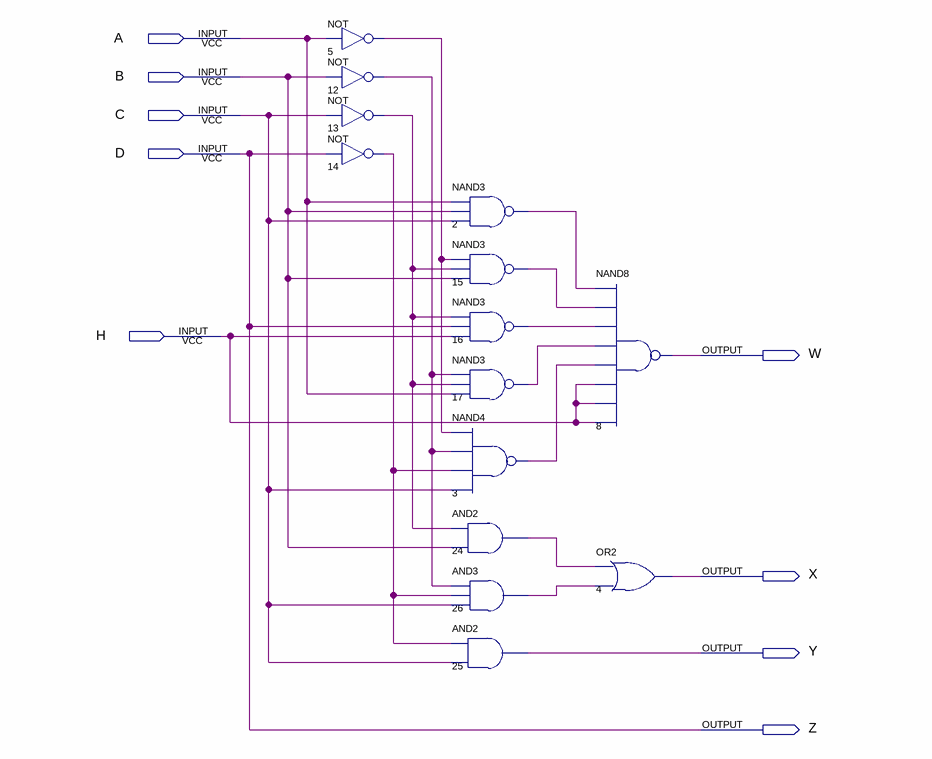
[diagram p0: schematic sheet]
// Quartus schematic codewandler_01.bdf as structural Verilog: 14 symbols, 9 pins
module codewandler_01 (
  input  A,
  input  B,
  input  C,
  input  D,
  input  H,
  output W,
  output X,
  output Y,
  output Z
);

  wire n2_out, n3_out, n5_out, n12_out, n13_out, n14_out, n15_out, n16_out, n17_out, n24_out, n26_out;

  not u_5 (n5_out, A);
  not u_12 (n12_out, B);
  not u_13 (n13_out, C);
  not u_14 (n14_out, D);
  nand u_2 (n2_out, A, B, C);
  nand u_15 (n15_out, n5_out, n13_out, B);
  nand u_16 (n16_out, n13_out, D, H);
  nand u_17 (n17_out, n12_out, n13_out, A);
  nand u_3 (n3_out, n5_out, n12_out, n14_out, C);
  and u_24 (n24_out, n13_out, B);
  and u_26 (n26_out, n12_out, n14_out, C);
  and u_25 (Y, n14_out, C);
  nand u_8 (W, n2_out, n15_out, n16_out, n17_out, n3_out, H, H, H);
  or u_4 (X, n24_out, n26_out);

  assign Z = D;
endmodule
